# EAGLE design carte contrôle (EAGLE 6.6.0)
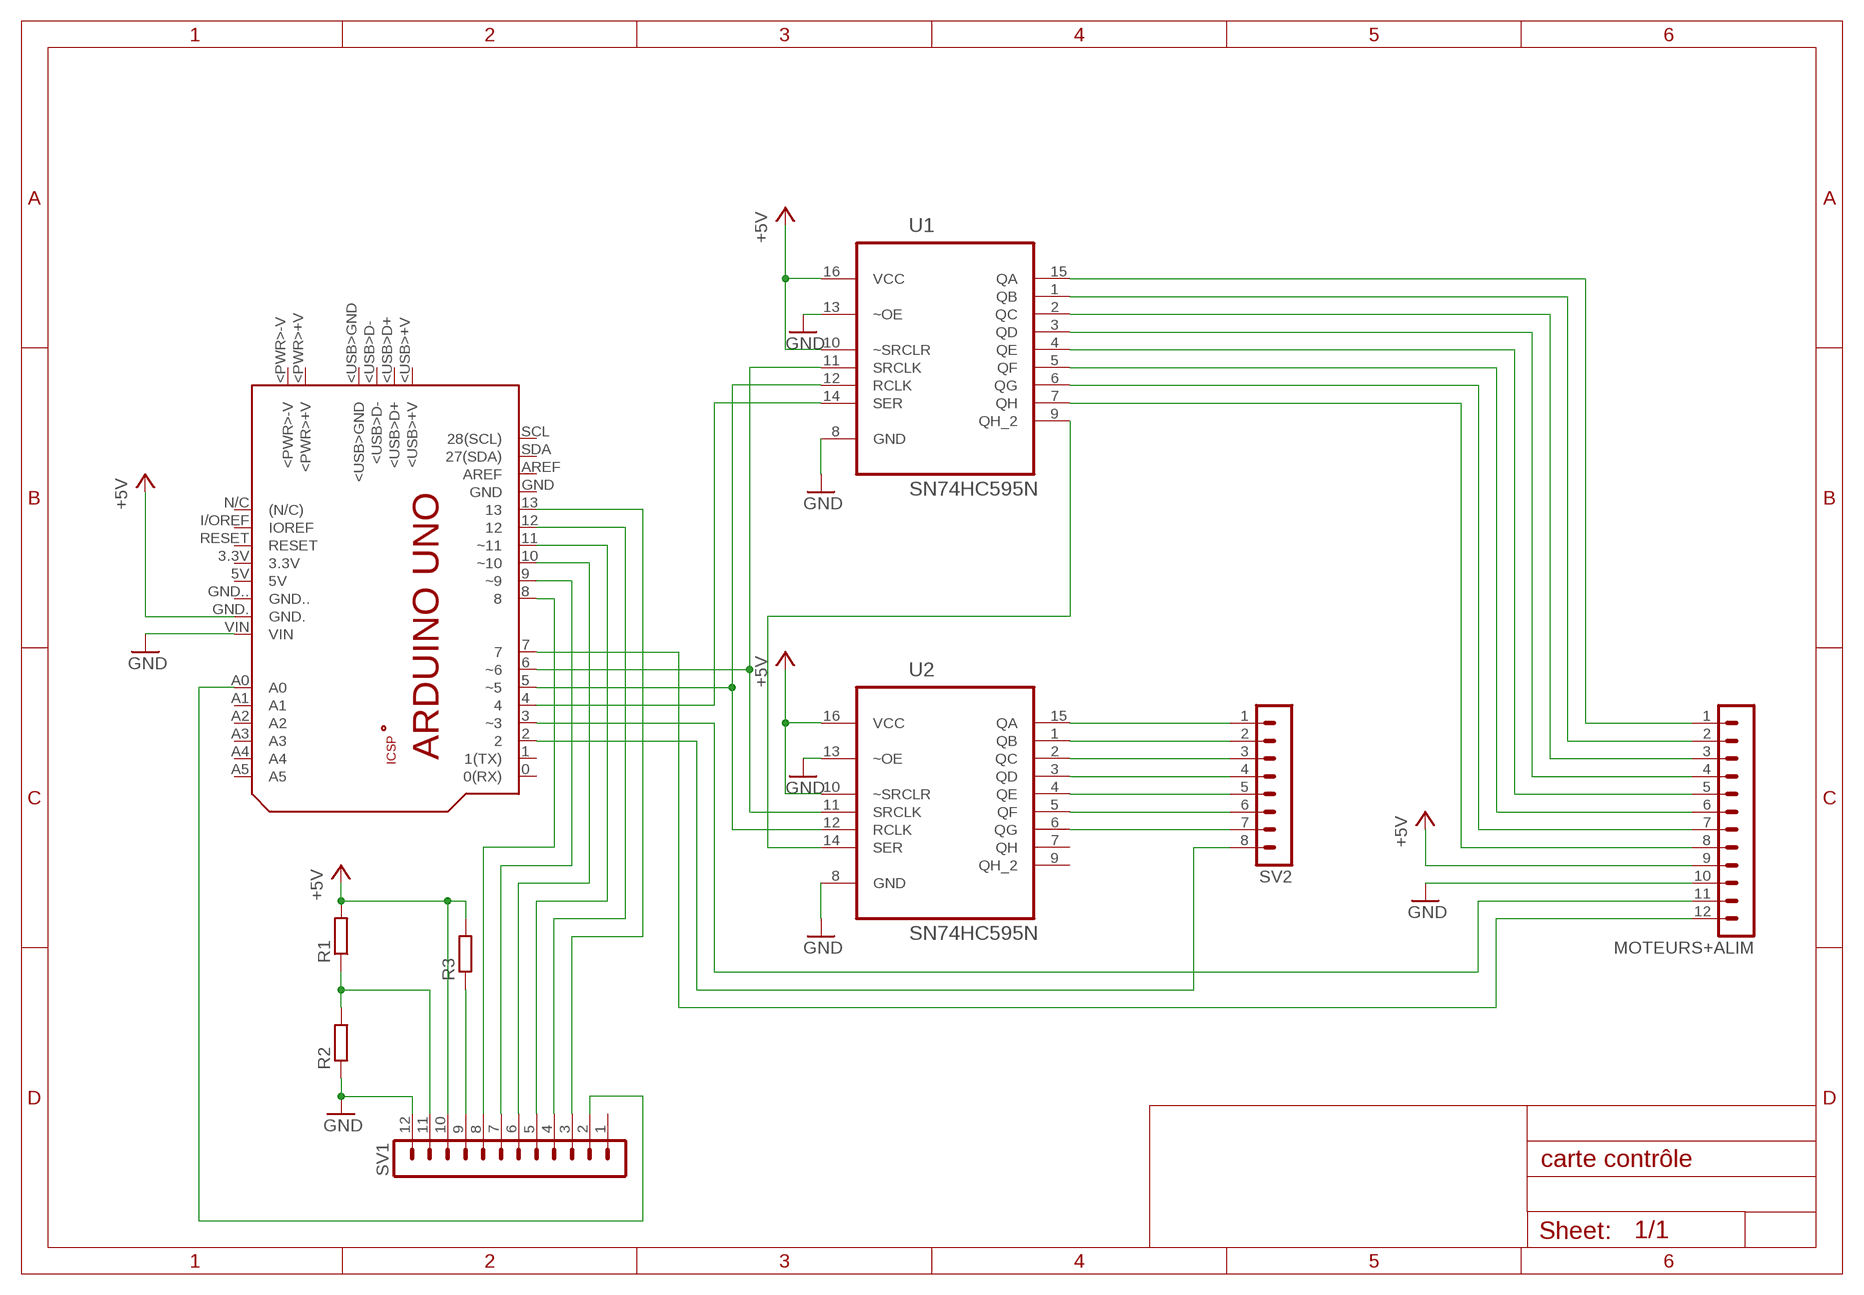
[diagram p0: schematic, sheet 1]

## Parts
MOTEURS+ALIM  MA12-1  [MA12-1]
PCB1  ARDUINO_UNO  [ARDUINO_UNO]
R1  R-EU_0207/10  [0207/10]
R2  R-EU_0207/10  [0207/10]
R3  R-EU_0207/10  [0207/10]
SV1  MA12-1  [MA12-1]
SV2  MA08-1  [MA08-1]
U1  SN74HC595N  [DIP254P762X508-16]
U2  SN74HC595N  [DIP254P762X508-16]

## Nets
+5V: MOTEURS+ALIM.9 PCB1.GND. R1.2 R3.2 SV1.10 U1.10(~SRCLR) U1.16(VCC) U2.10(~SRCLR) U2.16(VCC)
GND: MOTEURS+ALIM.10 PCB1.VIN R2.1 SV1.12 U1.8(GND) U1.13(~OE) U2.8(GND) U2.13(~OE)
N$1: U1.9(QH_2) U2.14(SER)
N$2: MOTEURS+ALIM.1 U1.15(QA)
N$3: MOTEURS+ALIM.2 U1.1(QB)
N$4: MOTEURS+ALIM.3 U1.2(QC)
N$5: MOTEURS+ALIM.4 U1.3(QD)
N$6: MOTEURS+ALIM.5 U1.4(QE)
N$7: MOTEURS+ALIM.6 U1.5(QF)
N$8: MOTEURS+ALIM.7 U1.6(QG)
N$9: MOTEURS+ALIM.8 U1.7(QH)
N$10: PCB1.5(~5) U1.12(RCLK) U2.12(RCLK)
N$11: PCB1.6(~6) U1.11(SRCLK) U2.11(SRCLK)
N$12: PCB1.4 U1.14(SER)
N$13: SV2.1 U2.15(QA)
N$14: SV2.2 U2.1(QB)
N$15: SV2.3 U2.2(QC)
N$16: SV2.4 U2.3(QD)
N$17: SV2.5 U2.4(QE)
N$18: SV2.6 U2.5(QF)
N$19: SV2.7 U2.6(QG)
N$20: MOTEURS+ALIM.11 PCB1.3(~3)
N$21: PCB1.2 SV2.8
N$22: PCB1.8 SV1.8
N$23: R1.1 R2.2 SV1.11
N$24: PCB1.9(~9) SV1.7
N$25: PCB1.10(~10) SV1.6
N$26: PCB1.11(~11) SV1.5
N$27: PCB1.12 SV1.4
N$28: PCB1.13 SV1.3
N$29: R3.1 SV1.9
N$30: PCB1.A0 SV1.2
N$31: MOTEURS+ALIM.12 PCB1.7
Unconnected: PCB1.0(0(RX)) PCB1.1(1(TX)) PCB1.3.3V PCB1.5V PCB1.+5V PCB1.<PWR>+V PCB1.<PWR>-V PCB1.<USB>+V PCB1.<USB>D+ PCB1.<USB>D- PCB1.<USB>GND PCB1.A1 PCB1.A2 PCB1.A3 PCB1.A4 PCB1.A5 PCB1.AREF PCB1.GND PCB1.GND.. PCB1.GND_ PCB1.I/OREF(IOREF) PCB1.MISO PCB1.MOSI PCB1.N/C((N/C)) PCB1.RESET PCB1.RESET. PCB1.SCK PCB1.SCL(28(SCL)) PCB1.SDA(27(SDA)) SV1.1 U2.7(QH) U2.9(QH_2)

## Library data of the parts
MOTEURS+ALIM SV1 = con-lstb:MA12-1: PIN HEADER; OC_FARNELL: unknown; OC_NEWARK: unknown
PCB1 = E14_Arduino:ARDUINO_UNO: Device for representing an Arduino Uno board with a footprint in an EAGLE design. Created by Dave Young for Element14. More EAGLE documentation at: http://www.element14.com/community/community/knode/cadsoft_eagle
R1-R3 = rcl:R-EU_: RESISTOR, European symbol
SV2 = con-lstb:MA08-1: PIN HEADER; OC_FARNELL: unknown; OC_NEWARK: unknown
U1 U2 = 74HC595:SN74HC595N: 8-BIT SHIFT REGISTERS WITH 3-STATE OUTPUT REGISTERS; MPN: SN74HC595N; OC_FARNELL: 9591664; OC_NEWARK: 60K6845; PACKAGE: PDIP-16; SUPPLIER: Texas Instruments

## Board
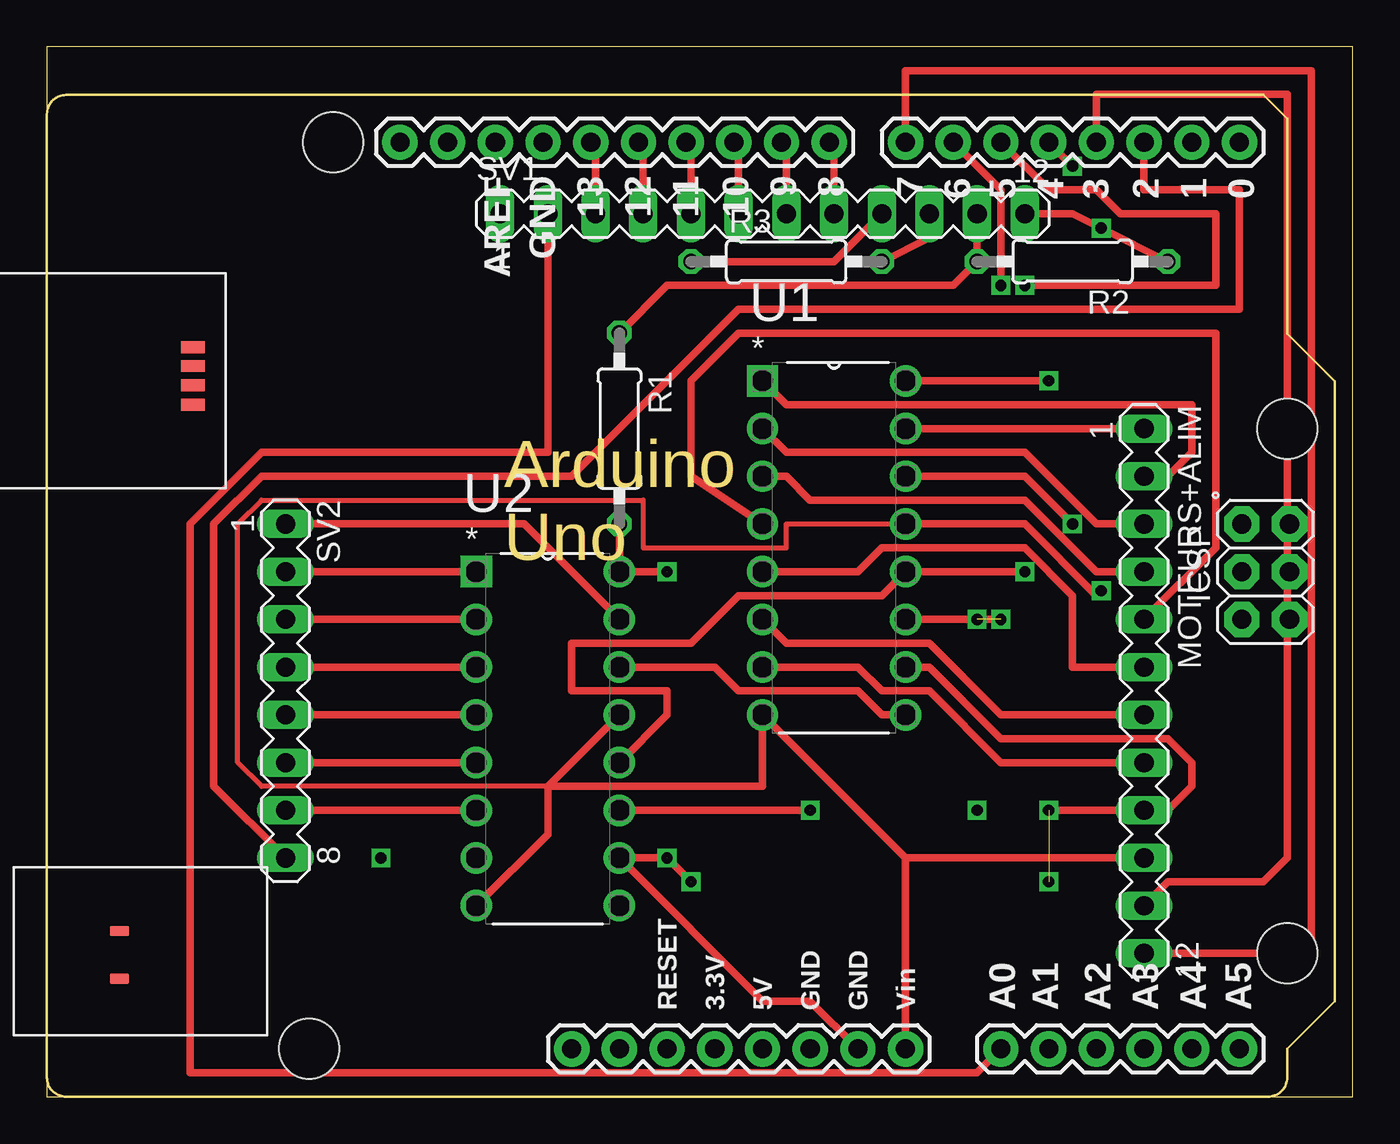
[diagram p1: board, top side]
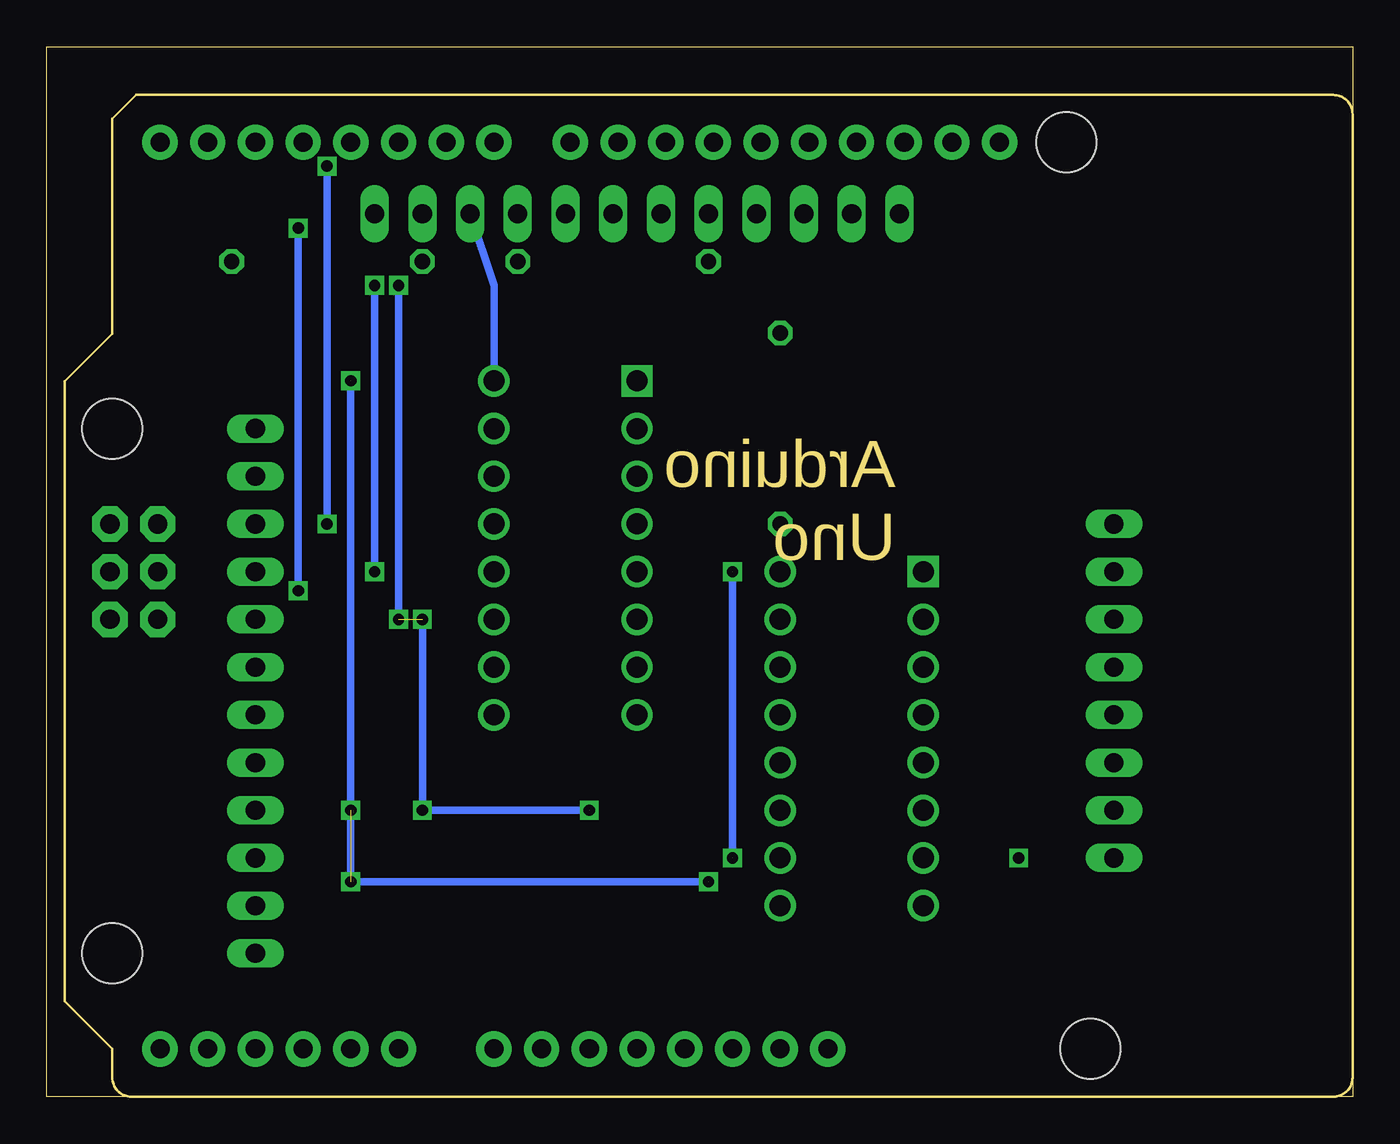
[diagram p2: board, bottom side, seen from below]

Size 69.52 x 55.87 mm. Coordinates in mm from the lower left corner, seen from the top.
Outline: 0,0 69.52,0 69.52,55.87 0,55.87 0,0
Copper layers (1*16): Top 0.035mm / dielectric 1.5mm / Bottom 0.035mm
Design rules "default": minimum track width 10mil, minimum drill 24mil, track to track 8mil, track to pad 8mil, pad to pad 8mil, via to via 8mil, smd to smd 8mil, copper to edge 40mil, drill to drill 8mil, minimum pad ring 10mil, minimum via ring 8mil, stop-mask expansion 4mil, vias tented up to drill 0mil, thermal gap 10mil

### Footprints (pad centres in the part's own frame; a part is rotated, then mirrored left to right if it is on the bottom)
MA12-1 = drill 1.016 long: 1 -13.97,0; 2 -11.43,0; 3 -8.89,0; 4 -6.35,0; 5 -3.81,0; 6 -1.27,0; 7 1.27,0; 8 3.81,0; 9 6.35,0; 10 8.89,0; 11 11.43,0; 12 13.97,0
ARDUINO_UNO = drill 1.016 pad 1.88: 0 63.5,50.8; 1 60.96,50.8; 2 58.42,50.8; 3 55.88,50.8; 3.3V 35.56,2.54; 4 53.34,50.8; 5 50.8,50.8; 5V 38.1,2.54; 6 48.26,50.8; 7 45.72,50.8; 8 41.656,50.8; 9 39.116,50.8; 10 36.576,50.8; 11 34.036,50.8; 12 31.496,50.8; 13 28.956,50.8; A0 50.8,2.54; A1 53.34,2.54; A2 55.88,2.54; A3 58.42,2.54; A4 60.96,2.54; A5 63.5,2.54; AREF 23.876,50.8; GND 26.416,50.8; GND. 43.18,2.54; GND.. 40.64,2.54; I/OREF 30.48,2.54; N/C 27.94,2.54; RESET 33.02,2.54; SCL 18.796,50.8; SDA 21.336,50.8; VIN 45.72,2.54 | drill 1.016 pad 1.88 octagon: +5V 66.167,30.48; GND_ 66.167,25.4; MISO 63.627,30.48; MOSI 66.167,27.94; RESET. 63.627,25.4; SCK 63.627,27.94 | smd 1.016 x 0.508: <PWR>+V 3.861,8.814; <PWR>-V 3.861,6.274 | smd 1.27 x 0.635: <USB>+V 7.772,39.878; <USB>D+ 7.772,38.887; <USB>D- 7.772,37.871; <USB>GND 7.772,36.83 | hole 3.2: 66.04,7.62; 66.04,35.56; 15.24,50.8; 13.97,2.54
0207/10 = drill 0.813 octagon: 1 -5.08,0; 2 5.08,0
MA08-1 = drill 1.016 long: 1 -8.89,0; 2 -6.35,0; 3 -3.81,0; 4 -1.27,0; 5 1.27,0; 6 3.81,0; 7 6.35,0; 8 8.89,0
DIP254P762X508-16 = drill 1.118 square: 1 -7.62,17.78 | drill 1.118: 2 -7.62,15.24; 3 -7.62,12.7; 4 -7.62,10.16; 5 -7.62,7.62; 6 -7.62,5.08; 7 -7.62,2.54; 8 -7.62,0; 9 0,0; 10 0,2.54; 11 0,5.08; 12 0,7.62; 13 0,10.16; 14 0,12.7; 15 0,15.24; 16 0,17.78

### Placement (x,y rotation side)
MOTEURS+ALIM  58.42,21.59 270 top
PCB1  0,0 0 top
R1  30.48,35.56 270 top
R2  54.61,44.45 180 top
R3  39.37,44.45 0 top
SV1  38.1,46.99 0 top
SV2  12.7,21.59 270 top
U1  45.72,20.32 0 top
U2  30.48,10.16 0 top

### Tracks (layer width: path | path; a pad name or v marks a point on that pad's centre or on a via)
+5V  (5 unrouted)
  Top 0.406: PCB1.GND. 40.64,5.08 38.1,5.08 U2.10 33.02,12.7 34.29,11.43 | U1.10 46.99,22.86 50.8,19.05 59.69,19.05 60.96,17.78 60.96,16.51 59.69,15.24 MOTEURS+ALIM.9 53.34,15.24 | R1.2 U2.16 33.02,27.94 | 53.34,38.1 U1.16 | R3.2 46.99,45.72 SV1.10
  Bottom 0.406: 34.29,11.43 53.34,11.43 53.34,38.1 | 33.02,27.94 33.02,12.7 | SV1.10 45.72,43.18 U1.16
GND  (via drill 0.6)
  Top 0.254: U1.13 39.37,30.48 39.37,29.21 31.75,29.21 31.75,31.75 11.43,31.75 10.16,30.48 10.16,17.78 11.43,16.51 26.67,16.51
  Top 0.406: U2.8 26.67,13.97 26.67,16.51 | 26.67,16.51 U2.13 | 45.72,12.7 U1.8 38.1,16.51 26.67,16.51 | 45.72,12.7 PCB1.VIN | MOTEURS+ALIM.10 45.72,12.7 | R2.1 v56.13,46.23 54.61,46.99 SV1.12 | U1.13 52.07,30.48 55.88,26.67 v56.13,26.92
  Bottom 0.406: v56.13,26.92 v56.13,46.23
N$1
  Top 0.406: U2.14 35.56,22.86 36.83,21.59 43.18,21.59 44.45,20.32 U1.9
N$2
  Top 0.406: MOTEURS+ALIM.1 U1.15
N$3
  Top 0.406: U1.1 39.37,36.83 60.96,36.83 60.96,34.29 59.69,33.02 MOTEURS+ALIM.2
N$4
  Top 0.406: MOTEURS+ALIM.3 55.88,30.48 52.07,34.29 39.37,34.29 U1.2
N$5
  Top 0.406: MOTEURS+ALIM.4 55.88,27.94 52.07,31.75 40.64,31.75 39.37,33.02 U1.3
N$6
  Top 0.406: U1.4 34.29,33.02 34.29,38.1 36.83,40.64 62.23,40.64 62.23,29.21 MOTEURS+ALIM.5
N$7
  Top 0.406: MOTEURS+ALIM.6 54.61,22.86 54.61,26.67 52.07,29.21 44.45,29.21 43.18,27.94 U1.5
N$8
  Top 0.406: U1.6 39.37,24.13 46.99,24.13 50.8,20.32 MOTEURS+ALIM.7
N$9
  Top 0.406: U1.7 43.18,22.86 44.45,21.59 46.99,21.59 50.8,17.78 MOTEURS+ALIM.8
N$10  (via drill 0.6)
  Top 0.406: U2.12 33.02,20.32 33.02,21.59 27.94,21.59 27.94,24.13 34.29,24.13 36.83,26.67 44.45,26.67 U1.12 v52.07,27.94 | PCB1.5 53.34,48.26 55.88,48.26 57.15,46.99 62.23,46.99 62.23,43.18 v52.07,43.18
  Bottom 0.406: v52.07,43.18 v52.07,27.94
N$11  (via drill 0.6)  (3 unrouted)
  Top 0.406: U2.11 40.64,15.24 | U1.11 v50.8,25.4 | PCB1.6 50.8,48.26 50.8,43.18
  Bottom 0.406: 49.53,25.4 49.53,15.24 40.64,15.24 | 50.8,43.18 v50.8,25.4
N$12  (via drill 0.6)
  Top 0.406: U1.14 52.07,33.02 v54.61,30.48 | v54.61,49.53 PCB1.4
  Bottom 0.406: v54.61,30.48 v54.61,49.53
N$13
  Top 0.406: SV2.1 25.4,30.48 U2.15
N$14
  Top 0.406: SV2.2 U2.1
N$15
  Top 0.406: SV2.3 U2.2
N$16
  Top 0.406: SV2.4 U2.3
N$17
  Top 0.406: SV2.5 U2.4
N$18
  Top 0.406: SV2.6 U2.5
N$19
  Top 0.406: SV2.7 U2.6
N$20
  Top 0.406: MOTEURS+ALIM.11 59.69,11.43 64.77,11.43 66.04,12.7 66.04,53.34 55.88,53.34 PCB1.3
N$21
  Top 0.406: SV2.8 8.89,16.51 8.89,30.48 11.43,33.02 27.94,33.02 36.83,41.91 63.5,41.91 63.5,48.26 58.42,48.26 PCB1.2
N$22
  Top 0.406: PCB1.8 41.91,50.55 SV1.8
N$23
  Top 0.406: SV1.11 R2.2 48.26,43.18 33.02,43.18 R1.1
N$24
  Top 0.406: PCB1.9 39.37,50.55 SV1.7
N$25
  Top 0.406: PCB1.10 36.83,50.55 SV1.6
N$26
  Top 0.406: PCB1.11 34.29,50.55 SV1.5
N$27
  Top 0.406: PCB1.12 31.75,50.55 SV1.4
N$28
  Top 0.406: PCB1.13 29.21,50.55 SV1.3
N$29
  Top 0.406: R3.1 41.91,44.45 SV1.9
N$30
  Top 0.406: SV1.2 26.67,34.29 11.43,34.29 7.62,30.48 7.62,1.27 49.53,1.27 PCB1.A0
N$31
  Top 0.406: PCB1.7 45.72,54.61 67.31,54.61 67.31,7.62 MOTEURS+ALIM.12
N$32  (via drill 0.6)
  other vias: 17.78,12.7
N$35  (via drill 0.6)
  other vias: 53.34,38.1
N$36  (via drill 0.6)
  other vias: 33.02,12.7
N$37  (via drill 0.6)
  other vias: 53.34,15.24
N$38  (via drill 0.6)
  other vias: 33.02,27.94
N$39  (via drill 0.6)
  other vias: 49.53,25.4
N$40  (via drill 0.6)
  other vias: 49.53,15.24
N$41  (via drill 0.6)
  other vias: 40.64,15.24
N$42  (via drill 0.6)
  other vias: 53.34,11.43
N$43  (via drill 0.6)
  other vias: 34.29,11.43
N$44  (via drill 0.6)
  other vias: 50.8,43.18